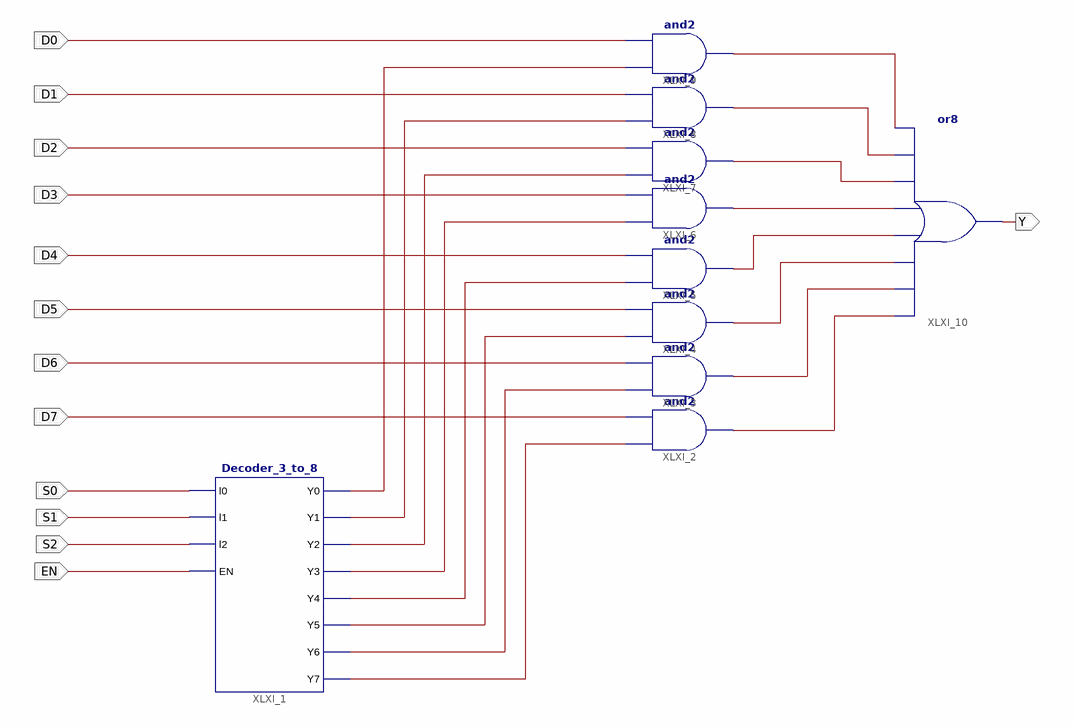
[diagram p0: schematic sheet 1]
// Xilinx ISE schematic Mux_8_to_1.sch (spartan3e) as structural Verilog: 10 symbols, 13 ports
module Mux_8_to_1 (
  input  S0,
  input  S1,
  input  S2,
  input  EN,
  input  D7,
  input  D6,
  input  D5,
  input  D4,
  input  D3,
  input  D2,
  input  D1,
  input  D0,
  output Y
);

  wire XLXN_5, XLXN_7, XLXN_8, XLXN_13, XLXN_19, XLXN_20, XLXN_21, XLXN_22, XLXN_23, XLXN_26, XLXN_27,
       XLXN_29, XLXN_30, XLXN_31, XLXN_32, XLXN_33;

  Decoder_3_to_8 XLXI_1 (
    .EN(EN), .l0(S0), .l1(S1), .l2(S2), .Y0(XLXN_23), .Y1(XLXN_26), .Y2(XLXN_27), .Y3(XLXN_29), .Y4(XLXN_30),
    .Y5(XLXN_31), .Y6(XLXN_32), .Y7(XLXN_33));
  and XLXI_2 (XLXN_21, XLXN_33, D7);
  and XLXI_3 (XLXN_20, XLXN_32, D6);
  and XLXI_4 (XLXN_19, XLXN_31, D5);
  and XLXI_5 (XLXN_22, XLXN_30, D4);
  and XLXI_6 (XLXN_13, XLXN_29, D3);
  and XLXI_7 (XLXN_8, XLXN_27, D2);
  and XLXI_8 (XLXN_7, XLXN_26, D1);
  and XLXI_9 (XLXN_5, XLXN_23, D0);
  or XLXI_10 (Y, XLXN_21, XLXN_20, XLXN_19, XLXN_22, XLXN_13, XLXN_8, XLXN_7, XLXN_5);
endmodule
